# EasyEDA Pro project PCB1.epro

# Board PCB1
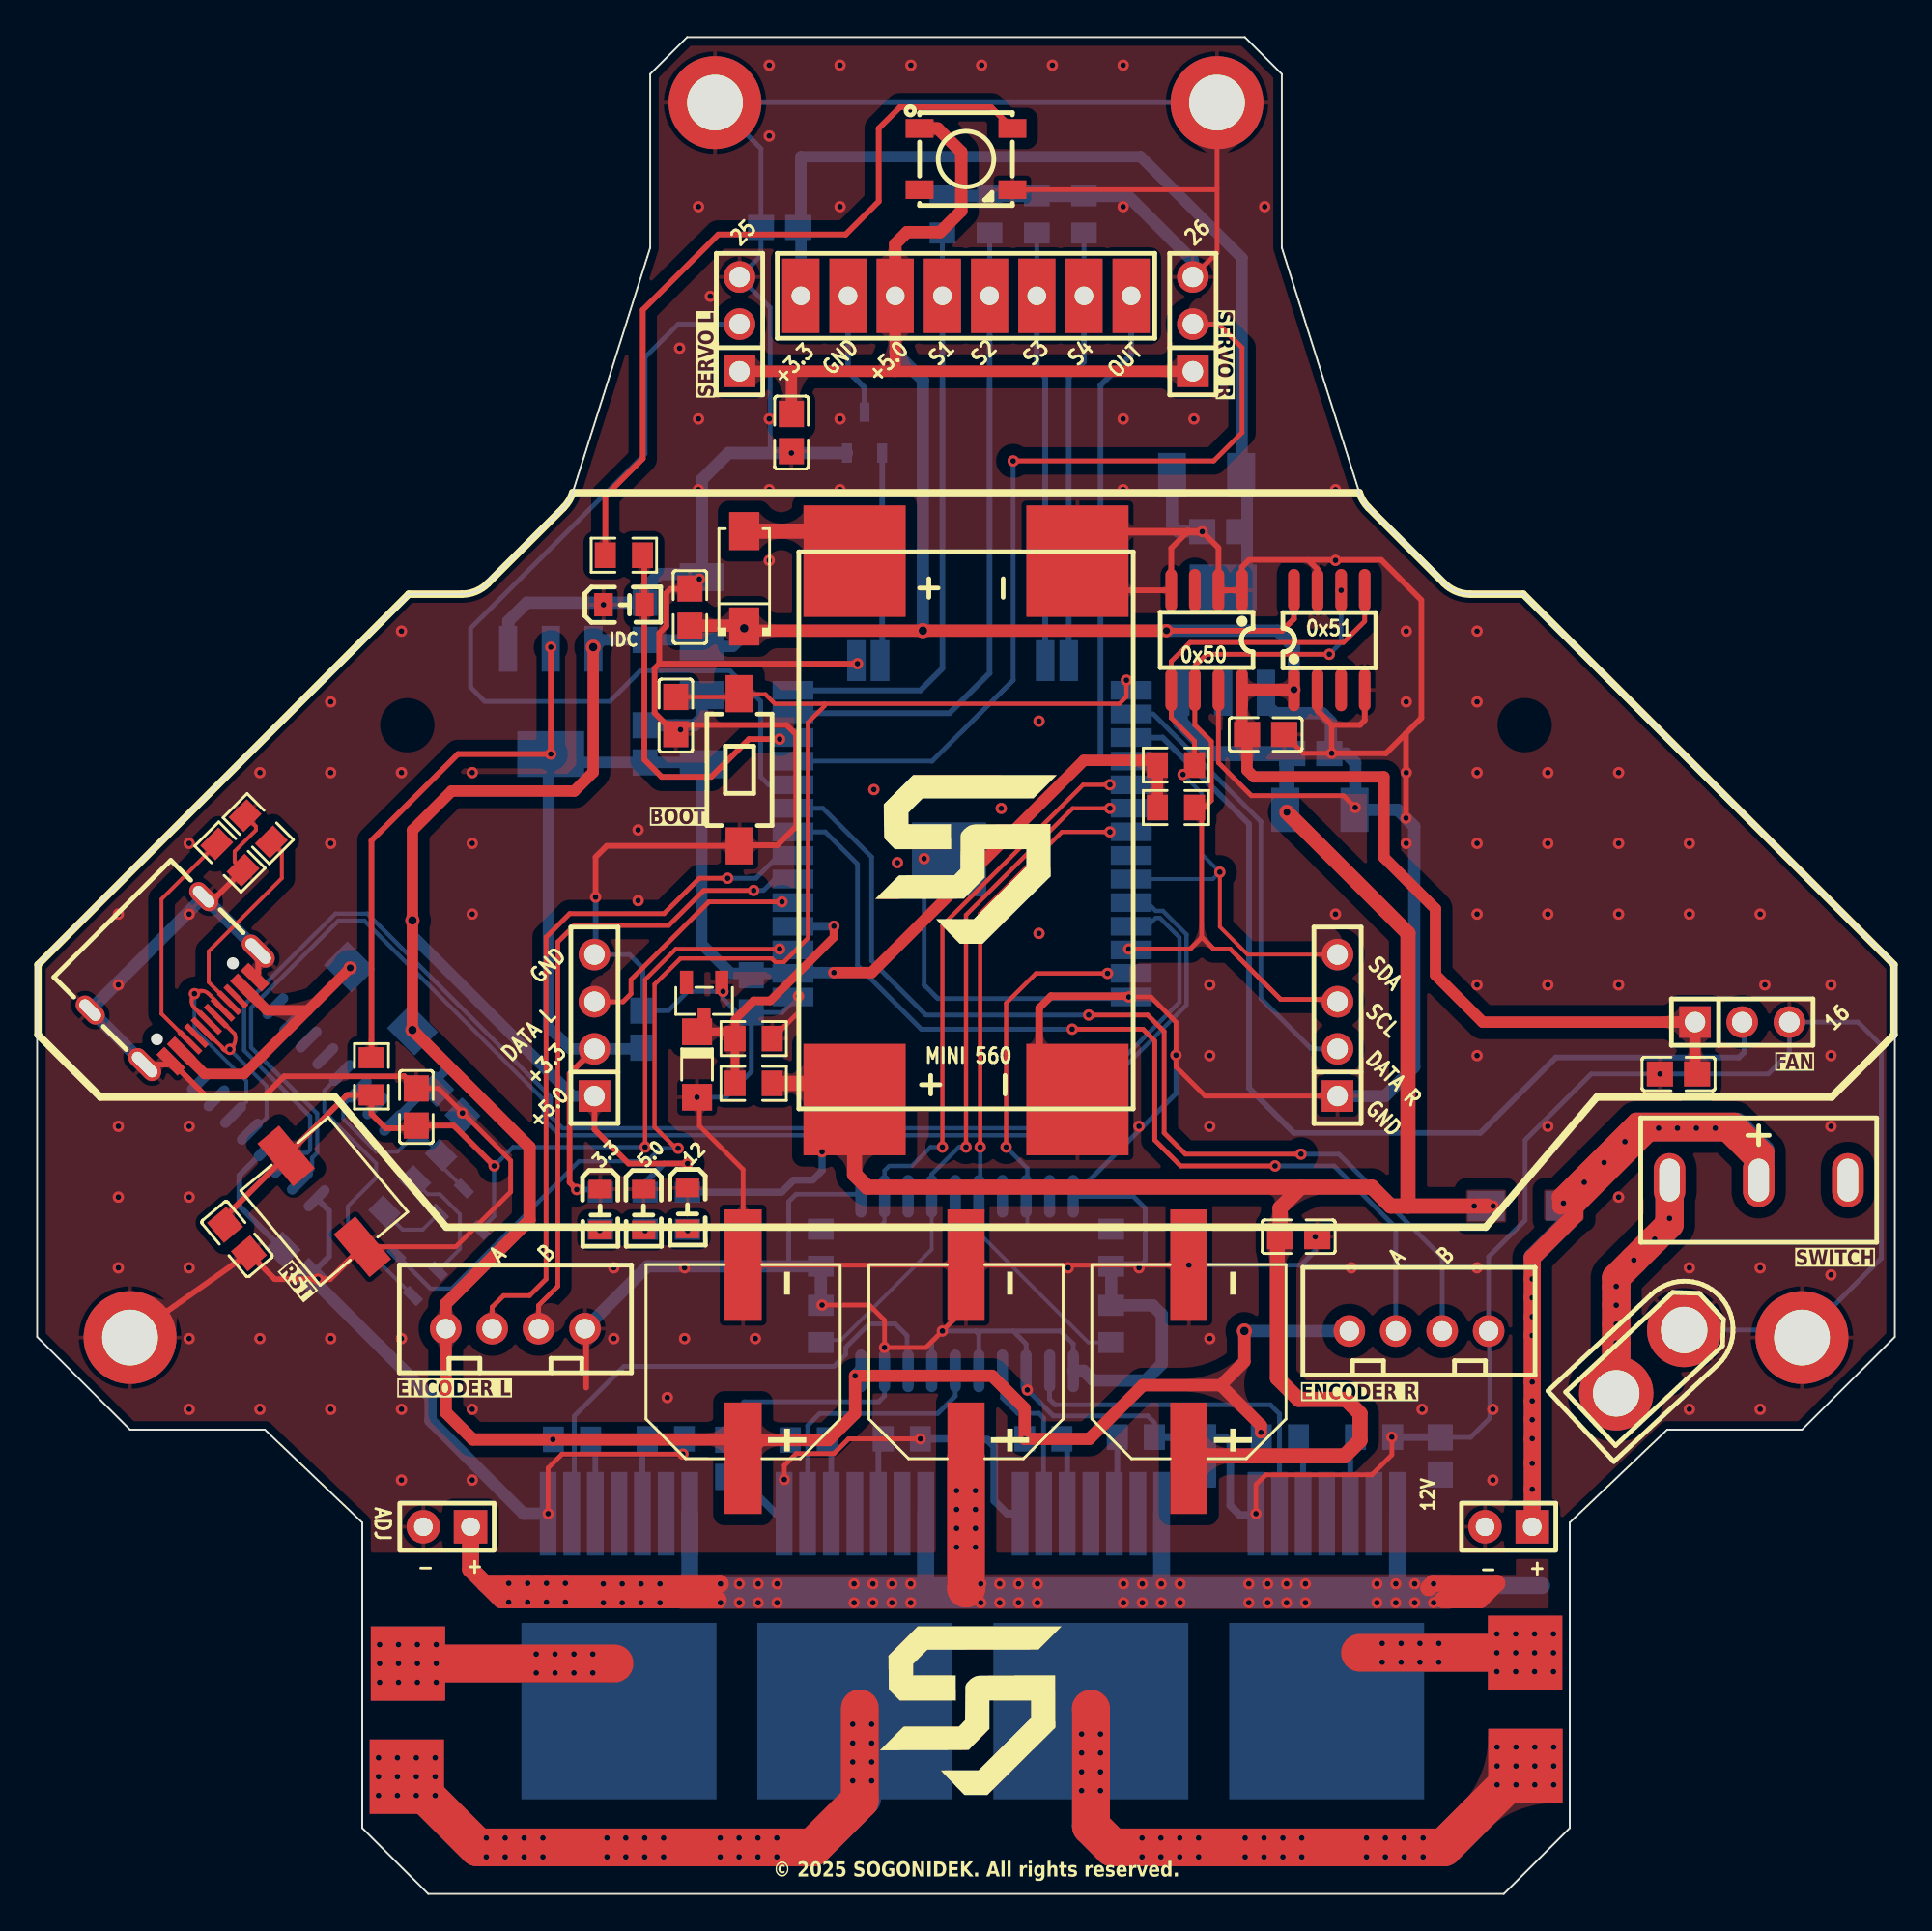
[diagram p0: board, top side]
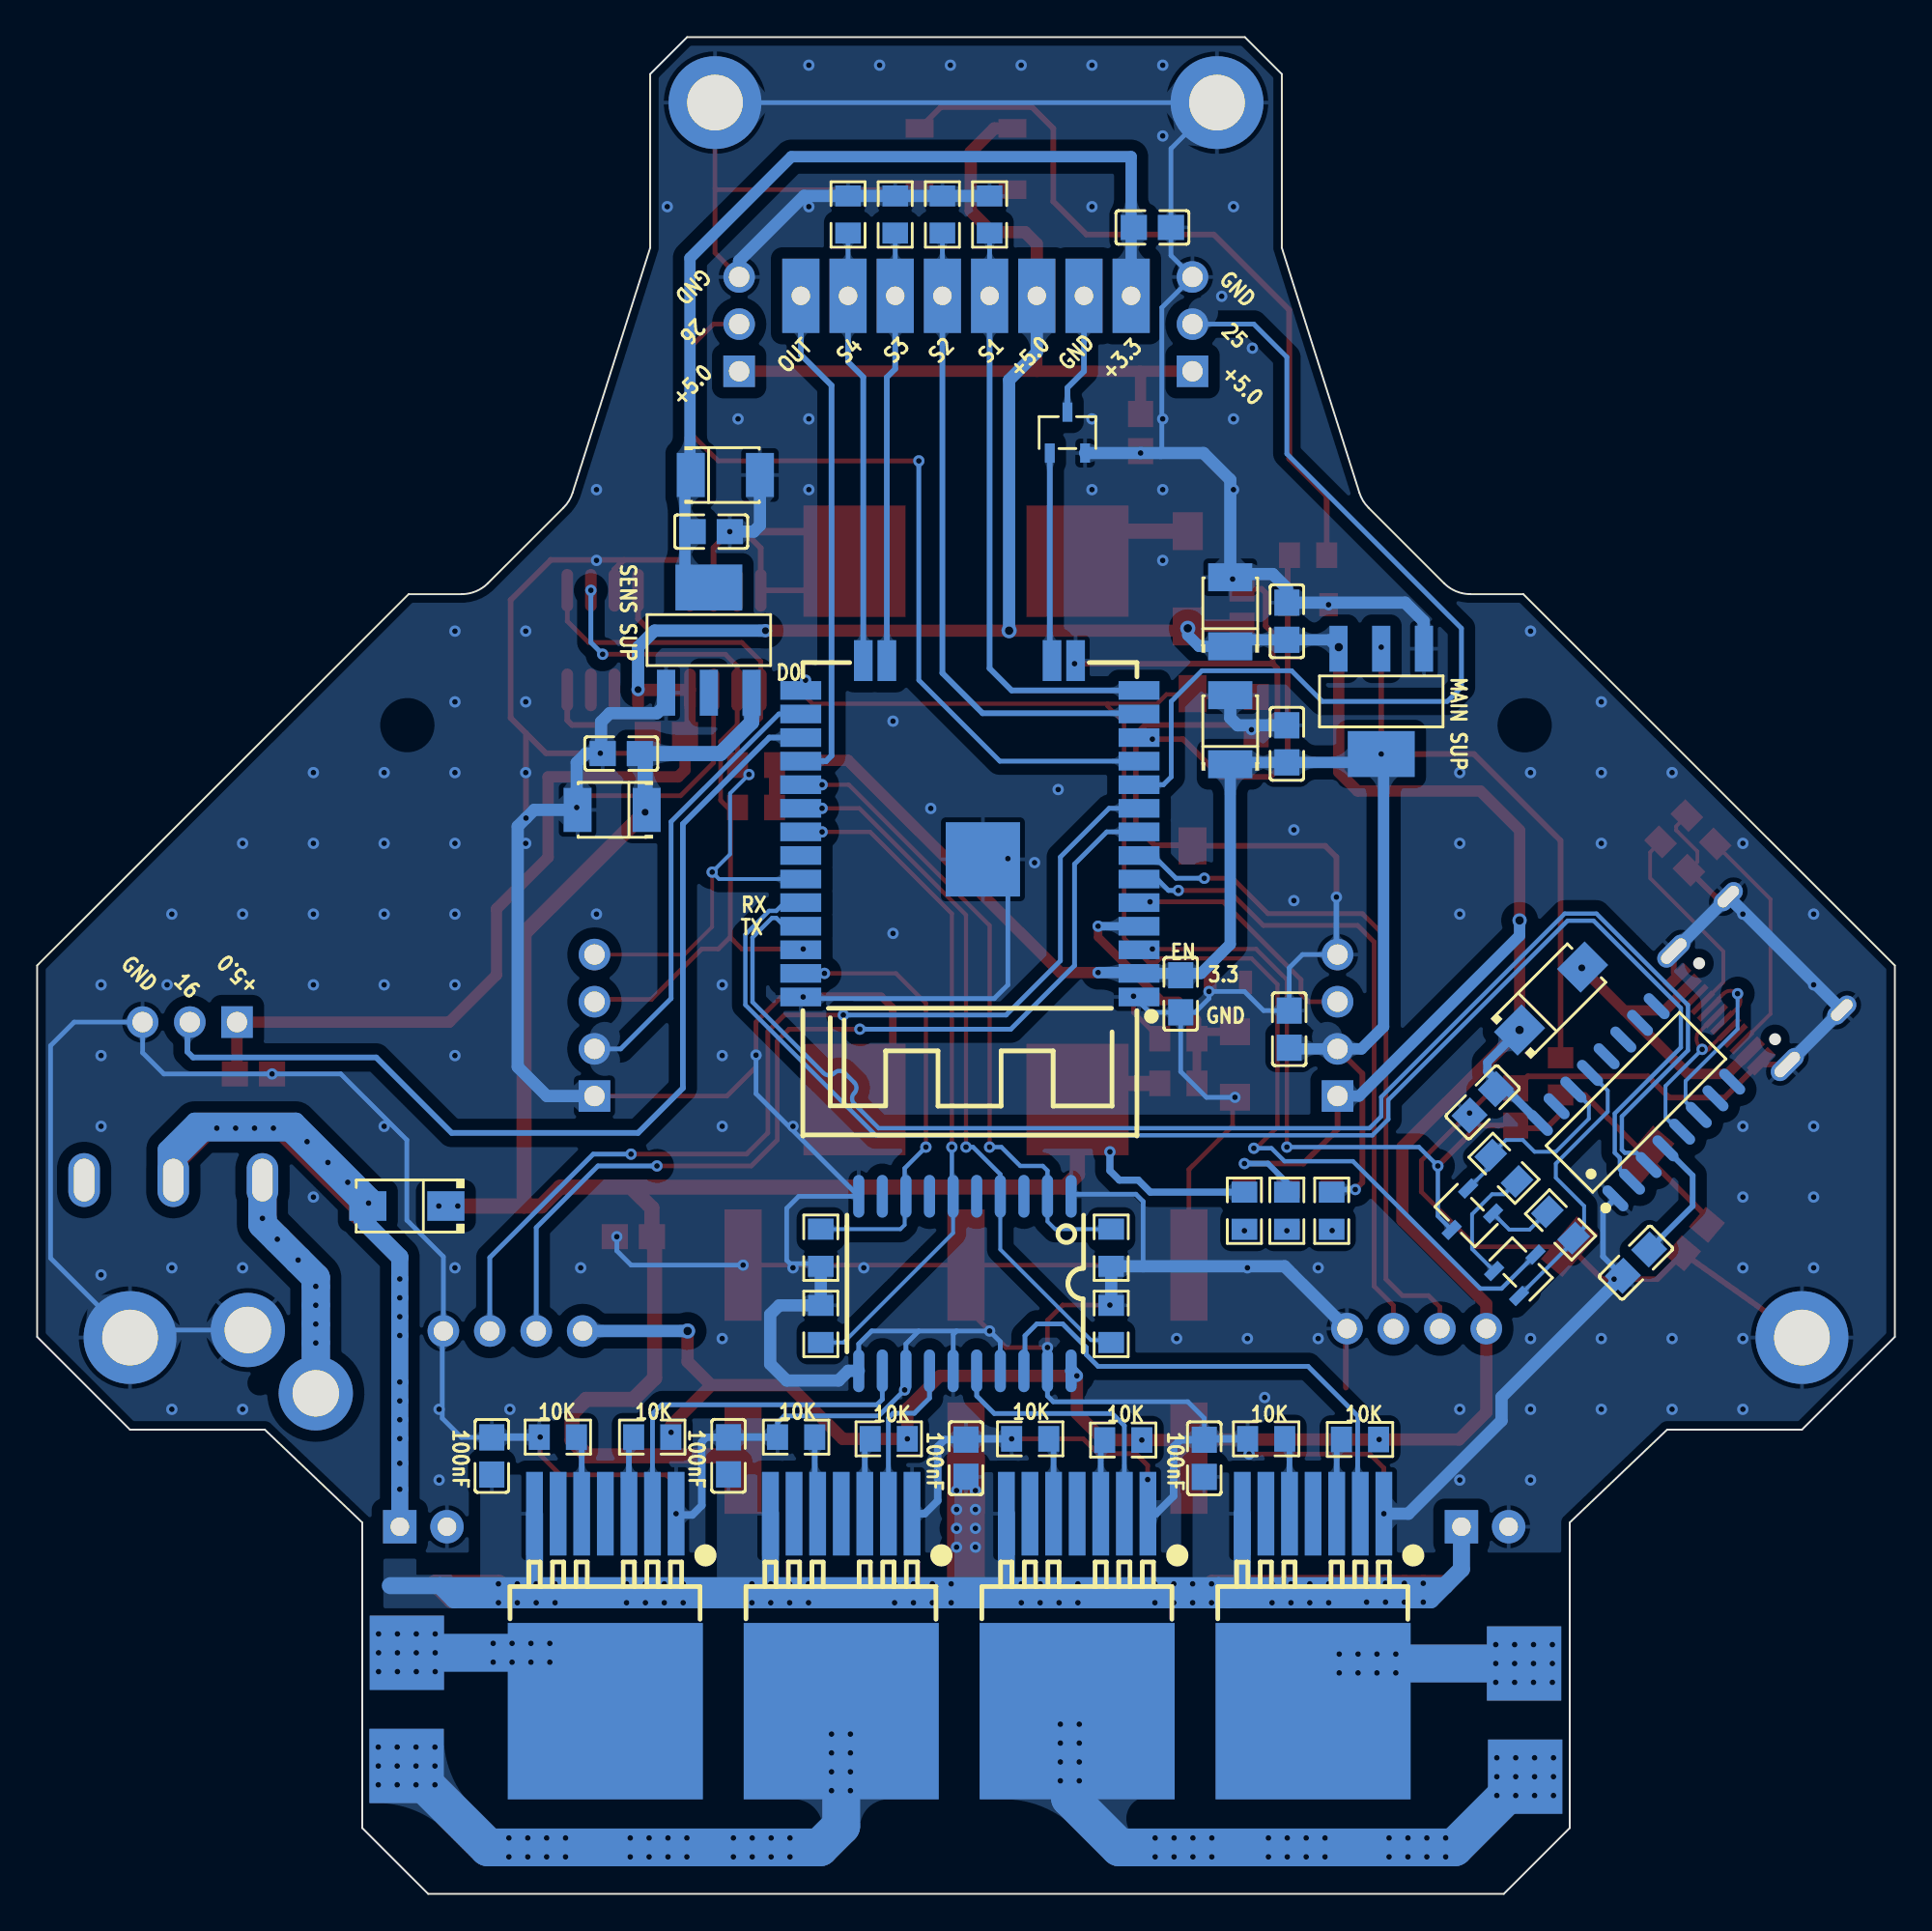
[diagram p1: board, bottom side, seen from below]

Outline 100 x 100 mm; copper layers: Top Layer, Bottom Layer. Coordinates in mm from the lower left corner of the outline.
Outline path: 0,50 0,30 5,25 12.26,25 17.5,20 17.5,3.55 21.05,0 78.95,0 82.5,3.55 82.5,20 87.74,25 95,25 100,30 100,50 80,70 77.15,70 arc(76.39,70.15) 75.74,70.59 71.67,74.65 arc(71.37,75.03) 71.18,75.47 67,88.66 67,98.01 65.01,100 34.99,100 33,98.01 33,88.66 28.82,75.47 arc(28.63,75.03) 28.33,74.65 24.26,70.59 arc(23.61,70.15) 22.85,70 20,70 0,50
Stack: Top Layer 0.035mm / Dielectric1 1.51mm FR4 er 4.5 / Bottom Layer 0.035mm

## Design rules (mm)
net TXD0: DP1
net RXD0: DP1
template: Custom Config
spacing copperThickness1oz (default): track to track 0.102, other pairs 0.152 to 0.3
spacing copperThickness2oz: track to track 0.203, other pairs 0.152 to 0.3
track width copperThickness1oz (default): min 0.127, default 0.254, max 2.54
track width copperThickness2oz: min 0.203, default 0.254, max 2.54
differential pair differentialPair (default): width min 0.127, default 0.254, max 2.54; gap min 0.152, default 0.152
via viaSize (default): diameter min 0.5, default 0.61, max 10; hole min 0.3, default 0.305, max 6.299
pour e1695 uses copperRegion
pour e456 uses copperRegion
pour e769 uses copperRegion

## Placement (name value [footprint] x y rotation side)
3.3  -  [LED0805-RD_GREEN]  30.31 36.86 270 top
5.0  -  [LED0805-RD_GREEN]  32.65 36.86 270 top
12  -  [LED0805-RD_GREEN]  35.01 36.92 270 top
12V  -  [HDR-TH_2P-P2.54-V-M-1]  79.21 19.77 180 top
C1  100nF  [C0805]  32.6 46.57 90 bottom
C2  100nF  [C0805]  40.6 78.7 270 top
C17  100nF  [C0805]  34.38 63.46 270 top
C18  100nF  [C0805]  10.76 35.27 310 top
C19  100nF  [C0805]  32.73 68.54 90 bottom
C20  100nF  [C0805]  32.73 61.94 90 bottom
C21  10uF  [CASE-B_3528]  35.78 69.05 90 bottom
C22  10uF  [CASE-B_3528]  35.78 62.7 90 bottom
C23  100nF  [C0805]  38.44 48.48 270 bottom
C24  100nF  [C0805]  39.97 89.75 180 bottom
C26  100nF  [C0805]  88.35 44.16 180 top
C27  100nF  [C0805]  66.13 62.45 0 top
C28  100nF  [C0805]  68.56 61.41 0 bottom
C29  100nF  [C0805]  63.72 73.37 180 bottom
C30  10uF  [CASE-B_3528]  69.05 58.38 0 bottom
C31  10uF  [CASE-B_3528]  62.95 76.42 180 bottom
C32  100nF  [C0805]  67.91 35.39 0 top
C33  100nF  [C0805]  35.14 69.3 90 top
C34  100nF  [C0805]  22.19 42.63 315 bottom
C35  100nF  [C0805]  13.93 34 135 bottom
C36  100nF  [C0805]  37.17 23.46 270 bottom
C37  100nF  [C0805]  75.53 23.58 270 bottom
C38  100nF  [C0805]  62.78 23.59 270 bottom
C39  100nF  [C0805]  50 23.46 270 bottom
C40  100nF  [C0805]  20.41 42.38 90 top
CN1  XT30UW-F.G.Y  [CONN-TH_XT30UW-F.G.Y]  86.83 28.66 223 top
D1  SS110  [SMA_L4.2-W2.6-LS5.1-RD]  18.5 48.22 135 bottom
D6  SS34  [SMA_L4.4-W2.8-LS5.4-RD]  38.06 70.83 90 top
D7  ZENER  [SOT-23-3_L2.9-W1.3-P1.90-LS2.4-BR]  35.9 48.09 90 top
D8  TZMB16-GS08  [SOD-80_L3.5-W1.5-RD]  35.52 44.67 270 top
DC1  Mini 560 Step-down  [MINI 560]  41 42.28 90 top
H8  -  [HDR-TH_8P-P2.54-V-M]  50 86.07 0 top
H9  PINHEADER EXT  [HDR-TH_4P-P2.54-V-F]  30 46.78 90 top
H10  PINHEADER EXT2  [HDR-TH_4P-P2.54-V-F]  70 46.78 90 top
H11  -  [HDR-TH_3P-P2.54-V-M]  37.81 84.54 90 top
H12  -  [HDR-TH_3P-P2.54-V-M]  62.21 84.54 90 top
H13  -  [HDR-TH_3P-P2.54-V-M]  91.78 46.95 0 top
H15  -  [HDR-TH_2P-P2.54-V-M-1]  22.06 19.77 180 top
IDC  -  [LED0805-RD_GREEN]  31.59 69.43 0 top
LED3  WS2812B-B/W  [LED-SMD_4P-L5.0-W5.0-BL_TC5050RGB]  50 93.43 0 top
Q1  J3Y  [SOT-23-3_L3.0-W1.7-P0.95-LS2.9-BR]  23.08 36.54 135 bottom
Q2  J3Y  [SOT-23-3_L3.0-W1.7-P0.95-LS2.9-BR]  20.12 33.65 315 bottom
Q3  J3Y  [SOT-23-3_L3.0-W1.7-P0.95-LS2.9-BR]  44.54 78.7 270 bottom
R2  10K  [R0805]  66.89 24.6 0 bottom
R3  10K  [R0805]  71.97 24.6 180 bottom
R4  10K  [R0805]  54.16 24.51 0 bottom
R5  10K  [R0805]  59.14 24.6 180 bottom
R6  10K  [R0805]  41.54 24.44 0 bottom
R7  10K  [R0805]  46.54 24.51 180 bottom
R8  10K  [R0805]  28.79 24.47 0 bottom
R9  10K  [R0805]  33.84 24.51 180 bottom
R32  10K  [R0805]  18 36.03 225 bottom
R33  10K  [R0805]  21.04 39.08 225 bottom
R43  5.1K  [R0805]  11.9 57.37 135 top
R44  5.1K  [R0805]  10.38 55.84 315 top
R45  10K  [R0805]  42.19 34.8 90 bottom
R46  10K  [R0805]  42.19 30.7 270 bottom
R48  10K  [R0805]  57.82 34.8 90 bottom
R49  10K  [R0805]  57.82 30.7 270 bottom
R50  4K7  [R0805]  61.3 60.79 180 top
R51  4K7  [R0805]  61.3 58.51 180 top
R52  10K  [R0805]  18 44.03 270 top
R54  47K  [R0805]  38.57 43.65 180 top
R55  4K7  [R0805]  38.57 46.06 0 top
R56  10K  [R0805]  56.35 90.45 90 bottom
R57  10K  [R0805]  53.81 90.45 90 bottom
R58  10K  [R0805]  51.27 90.45 90 bottom
R59  10K  [R0805]  48.73 90.45 90 bottom
R60  330  [R0805]  31.59 72.1 0 top
R61  5.1k  [R0805]  35.01 36.79 270 bottom
R63  5.1k  [R0805]  30.31 36.79 270 bottom
R64  5.1k  [R0805]  32.73 36.79 270 bottom
SW1  SWITCH  [SW-TH_SHOU-HAN_SS12D10G4]  92.67 38.44 0 top
SW2  PUSH BUTTON  [SW-SMD_L6.0-W6.0-LS6.6]  15.46 37.3 130 top
SW10  PTS636  [KEY-SMD_L6.0-W3.5-LS8.7]  37.81 60.54 90 top
U1  BTN7960  [PG-TO263-7_L9.9-W9.2-P1.27-LS14.9-BR]  69.42 15.03 90 bottom
U2  BTN7960  [PG-TO263-7_L9.9-W9.2-P1.27-LS14.9-BR]  56.72 15.03 90 bottom
U3  BTN7960  [PG-TO263-7_L9.9-W9.2-P1.27-LS14.9-BR]  44.02 15.03 90 bottom
U4  BTN7960  [PG-TO263-7_L9.9-W9.2-P1.27-LS14.9-BR]  31.32 15.03 90 bottom
U5  -  [HOLE ARRAY 3MM]  5 29.96 0 top
U6  -  [HOLE ARRAY 3MM]  95 29.96 0 top
U7  -  [HOLE ARRAY 3MM]  63.51 96.47 0 top
U8  -  [HOLE ARRAY 3MM]  36.49 96.47 0 top
U11  AT24C256M/TR  [SOP-8_L4.9-W3.9-P1.27-LS6.0-BL]  62.95 67.53 180 top
U17  CH340C  [SOP-16_L10.0-W3.9-P1.27-LS6.0-BL]  13.93 42.63 135 bottom
U19  AMS 3.3  [SOT-223-4_L6.5-W3.5-P2.30-LS7.0-BR]  27.65 64.22 90 bottom
U20  74HC244D  [SOIC-20_L12.8-W7.5-P1.27-LS10.3-TL]  50.06 32.87 270 bottom
U25  AMS 3.3  [SOT-223-4_L6.5-W3.5-P2.30-LS7.0-BR]  63.84 67.53 270 bottom
U26  470uF  [CAP-SMD_BD10.0-L10.3-W10.3-LS11.0-FD-1]  62 28.66 90 top
U27  470uF  [CAP-SMD_BD10.0-L10.3-W10.3-LS11.0-FD-1]  38 28.66 90 top
U28  470uF  [CAP-SMD_BD10.0-L10.3-W10.3-LS11.0-FD-1]  50 28.66 90 top
U31  SS54  [SMA_L4.3-W2.5-LS5.0-RD]  80.1 37.05 0 bottom
U33  ESP32-WROOM-32  [WIFIM-SMD_ESP-WROOM-32]  49.79 57.24 0 bottom
U34  AT24C256  [SOP-8_L4.9-W3.9-P1.27-LS6.0-BL]  69.56 67.53 0 top
U35  ENCODER_L  [CONN-TH_4P-P2.50-XH2.54-4P]  25.74 30.44 180 top
U36  ENCODER_R  [CONN-TH_4P-P2.50-XH2.54-4P]  74.38 30.31 180 top
U37  -  [PADSMD MOTOR]  80.1 12.98 0 top
U38  -  [PADSMD MOTOR]  80.11 6.89 0 top
U39  -  [PADSMD MOTOR]  19.9 6.31 0 top
U40  -  [PADSMD MOTOR]  19.96 12.41 0 top
USB3  TYPE-C  [USB-C-SMD_TYPE-C16PIN]  7.58 48.98 225 top

## Footprints (pads in the part's own frame, mm; a bottom-side part is the same pattern mirrored in y, then rotated)
C0805
  rect 1.41x1.35 smd: 1(-1,0) 2(1,0)
CAP-SMD_BD10.0-L10.3-W10.3-LS11.0-FD-1
  rect 6x2 smd: 1(-5.2,0) 2(5.2,0)
CASE-B_3528
  rect 1.506x2.376 smd: 1(-1.861,0) 2(1.861,0)
CONN-TH_4P-P2.50-XH2.54-4P
  round 1.7 hole 1.05: 1(3.75,0) 2(1.25,0) 3(-1.25,0) 4(-3.75,0)
CONN-TH_XT30UW-F.G.Y
  round 4 hole 2.5: 1(-2.5,0) 2(2.5,0)
HDR-TH_2P-P2.54-V-M-1
  rect 1.8x1.8 hole 1: 1(-1.27,0)
  round 1.8 hole 1: 2(1.27,0)
HDR-TH_3P-P2.54-V-M
  rect 1.7x1.7 hole 1.1: 1(-2.54,0)
  round 1.7 hole 1.1: 2(0,0) 3(2.54,0)
HDR-TH_4P-P2.54-V-F
  rect 1.7x1.7 hole 1.1: 1(-3.81,0)
  round 1.7 hole 1.1: 2(-1.27,0) 3(1.27,0) 4(3.81,0)
HDR-TH_8P-P2.54-V-M
  rect 2x4 hole 1: 1(-8.89,0) 2(-6.35,0) 3(-3.81,0) 4(-1.27,0) 5(1.27,0) 6(3.81,0) 7(6.35,0) 8(8.89,0)
HOLE ARRAY 3MM
  round 5 hole 3: 1(0,0)
KEY-SMD_L6.0-W3.5-LS8.7
  rect 2x1.5 smd: 1(-4.1,0) 2(4.1,0)
LED0805-RD_GREEN
  rect 1x1.25 smd: 1(-1.1,0) 2(1.1,0)
LED-SMD_4P-L5.0-W5.0-BL_TC5050RGB
  rect 1.5x1 smd: 1(-2.5,1.65) 2(-2.5,-1.65) 3(2.5,-1.65) 4(2.5,1.65)
MINI 560
  rect 6x5.5 smd: 1(0.5,-3) 2(0.5,-15) 3(29.5,-15) 4(29.5,-3)
PADSMD MOTOR
  rect 4x4 smd: 1(0,0)
  rect 4x4 smd far side: 2(0,0)
PG-TO263-7_L9.9-W9.2-P1.27-LS14.9-BR
  rect 4.5x0.9 smd: 1(5.444,-3.81) 2(5.444,-2.54) 3(5.444,-1.27) 4(5.444,0) 5(5.444,1.27) 6(5.444,2.54) 7(5.444,3.81)
  rect 9.5x10.5 smd: 8(-5.19,0)
R0805
  rect 1.133x1.377 smd: 1(-1,0) 2(1,0)
SMA_L4.2-W2.6-LS5.1-RD
  rect 2.1x1.8 smd: 1(-2.4,0) 2(2.4,0)
SMA_L4.3-W2.5-LS5.0-RD
  rect 2x1.593 smd: 1(-2.1,0) 2(2.1,0)
SMA_L4.4-W2.8-LS5.4-RD
  rect 2.046x1.62 smd: 1(-2.566,0) 2(2.566,0)
SOD-80_L3.5-W1.5-RD
  rect 1.44x1.62 smd: 1(-1.765,0) 2(1.765,0)
SOIC-20_L12.8-W7.5-P1.27-LS10.3-TL
  oval 2.3x0.6 smd: 1(-4.7,5.715) 2(-4.7,4.445) 3(-4.7,3.175) 4(-4.7,1.905) 5(-4.7,0.635) 6(-4.7,-0.635) 7(-4.7,-1.905) 8(-4.7,-3.175) 9(-4.7,-4.445) 10(-4.7,-5.715) 11(4.7,-5.715) 12(4.7,-4.445) 13(4.7,-3.175) 14(4.7,-1.905) 15(4.7,-0.635) 16(4.7,0.635) 17(4.7,1.905) 18(4.7,3.175) 19(4.7,4.445) 20(4.7,5.715)
SOP-8_L4.9-W3.9-P1.27-LS6.0-BL
  oval 0.63x2.3 smd: 1(-1.905,-2.683) 2(-0.635,-2.683) 3(0.635,-2.683) 4(1.905,-2.683) 5(1.905,2.683) 6(0.635,2.683) 7(-0.635,2.683) 8(-1.905,2.683)
SOP-16_L10.0-W3.9-P1.27-LS6.0-BL
  oval 0.56x1.745 smd: 1(-4.445,-2.873) 2(-3.175,-2.873) 3(-1.905,-2.873) 4(-0.635,-2.873) 5(0.635,-2.873) 6(1.905,-2.873) 7(3.175,-2.873) 8(4.445,-2.873) 9(4.445,2.873) 10(3.175,2.873) 11(1.905,2.873) 12(0.635,2.873) 13(-0.635,2.873) 14(-1.905,2.873) 15(-3.175,2.873) 16(-4.445,2.873)
SOT-23-3_L2.9-W1.3-P1.90-LS2.4-BR
  rect 1.25x0.7 smd: 1(1,-0.95) 2(1,0.95) 3(-1,0)
SOT-23-3_L3.0-W1.7-P0.95-LS2.9-BR
  rect 1.038x0.532 smd: 1(1.101,-0.95) 2(1.101,0.95) 3(-1.101,0)
SOT-223-4_L6.5-W3.5-P2.30-LS7.0-BR
  rect 2.47x0.98 smd: 1(2.835,-2.3) 2(2.835,0) 3(2.835,2.3)
  rect 2.47x3.6 smd: 4(-2.835,0)
SW-SMD_L6.0-W6.0-LS6.6
  rect 3x1.512 smd: 1(-3.192,0) 2(3.192,0)
SW-TH_SHOU-HAN_SS12D10G4
  oval 1.7x2.9 hole 1.1x2.3: 1(-4.8,0) 2(0,0) 3(4.8,0)
USB-C-SMD_TYPE-C16PIN
  oval 1x2.1 hole 0.6x1.7: 1(-4.32,1.788) 2(4.32,1.788)
  oval 1x1.8 hole 0.6x1.4: 3(-4.32,-2.362) 4(4.32,-2.362)
  rect 0.6x1.6 smd: A1B12(-3.2,2.658) A4B9(-2.4,2.658) B1A12(3.2,2.658) B4A9(2.4,2.658)
  rect 0.3x1.6 smd: A5(-1.25,2.658) A6(-0.25,2.658) A7(0.25,2.658) A8(1.25,2.658) B5(1.75,2.658) B6(0.75,2.658) B7(-0.75,2.658) B8(-1.75,2.658)
WIFIM-SMD_ESP-WROOM-32
  rect 2.2x1.001 smd: 1(-9.104,8.931) 2(-9.104,7.66) 3(-9.104,6.391) 4(-9.104,5.12) 5(-9.104,3.85) 6(-9.104,2.58) 7(-9.104,1.31) 8(-9.104,0.041) 9(-9.104,-1.23) 10(-9.104,-2.499) 11(-9.104,-3.769) 12(-9.104,-5.04) 13(-9.104,-6.309) 14(-9.104,-7.58) 25(9.104,-7.58) 26(9.104,-6.309) 27(9.104,-5.04) 28(9.104,-3.769) 29(9.104,-2.499) 30(9.104,-1.23) 31(9.104,0.041) 32(9.104,1.31) 33(9.104,2.58) 34(9.104,3.85) 35(9.104,5.12) 36(9.104,6.391) 37(9.104,7.66) 38(9.104,8.931)
  rect 1.001x2.2 smd: 15(-5.689,-9.184) 16(-4.42,-9.184) 23(4.471,-9.184) 24(5.74,-9.184)
  rect 4x4 smd: 39(-0.7,1.52)

## Nets
+3.3V: C1.1 C20.1 C22.1 C23.1 H9.2 R50.2 R51.2 R52.1 R63.1 U19.2 U19.4 U33.2
+3.3VS: C24.1 C29.1 C31.1 H8.1 U25.2 U25.4
+5V: C2.1 C19.1 C21.1 C26.1 C27.1 C33.1 C34.1 D1.1 D6.1 H8.3 H9.1 H11.1 H12.1 H13.1 LED3.1 R2.1 R4.1 R6.1 R8.1 R64.1 U11.8 U17.16 U19.3 U20.20 U27.1 U34.1 U34.8 U35.1 U36.1
+12V: 12V.1 SW1.2 U31.2
GND: 3.3.1 5.0.1 12.1 12V.2 C1.2 C2.2 C17.2 C18.2 C19.2 C20.2 C21.2 C22.2 C23.2 C24.2 C26.2 C27.2 C28.2 C29.2 C30.2 C31.2 C32.2 C33.2 C34.2 C35.1 C36.1 C37.1 C38.1 C39.1 C40.2 CN1.1 D7.1 D8.2 DC1.2 DC1.3 H9.4 H10.1 H11.3 H12.3 H13.3 H15.2 IDC.1 LED3.3 Q3.2 R3.1 R5.1 R7.1 R9.1 R43.2 R44.2 R45.1 R46.1 R48.1 R49.1 R55.2 R56.2 R57.2 R58.2 R59.2 SW2.1 SW10.1 U1.1 U2.1 U3.1 U4.1 U5.1 U6.1 U7.1 U8.1 U11.1 U11.2 U11.4 U11.7 U17.1 U19.1 U20.1 U20.10 U20.11 U20.13 U20.15 U20.17 U20.19 U25.1 U26.2 U27.2 U28.2 U33.1 U33.15 U33.38 U33.39 U34.2 U34.4 U34.7 U35.4 U36.4 USB3.1 USB3.2 USB3.3 USB3.4 USB3.A1B12 USB3.B1A12
VBAT: C28.1 C30.1 C32.1 DC1.1 R54.1 R61.1 U25.3 U26.1 U31.1
VBUS: D1.2 USB3.A4B9 USB3.B4A9
ADJ: C36.2 C37.2 C38.2 C39.2 H15.1 U1.7 U2.7 U3.7 U4.7 U28.1
BAT_SENS: D7.3 D8.1 R54.2 R55.1 U33.4
BTNL: H9.3 U33.5
BTNR: H10.2 U33.26
D0: C17.1 Q2.3 SW10.2 U33.25
D+: U17.5 USB3.A6 USB3.B6
D-: U17.6 USB3.A7 USB3.B7
DTR: Q2.2 R32.2 U17.13
EN: C18.1 C40.1 Q1.3 R52.2 SW2.2 U33.3
ENA_SENS: Q3.1 U33.16
ENCL1: U33.7 U35.2
ENCL2: U33.6 U35.3
ENCR1: U33.8 U36.2
ENCR2: U33.9 U36.3
FAN: H13.2 U33.27
IL1: R48.2 U20.8 U33.37
IL2: R49.2 U20.6 U33.31
IR1: R46.2 U20.4 U33.30
IR2: R45.2 U20.2 U33.29
LED: IDC.2 R60.2 U33.12
LED_CON: LED3.4 R60.1
OUT_ML1: U2.8 U38.1 U38.2
OUT_ML2: U1.8 U37.1 U37.2
OUT_MR1: U4.8 U40.1 U40.2
OUT_MR2: U3.8 U39.1 U39.2
PWM_ML1: U2.2 U20.14
PWM_ML2: U1.2 U20.12
PWM_MR1: U4.2 U20.18
PWM_MR2: U3.2 U20.16
RTS: Q1.2 R33.1 U17.14
RXD0: U17.2 U33.34
SCL: H10.3 R51.1 U11.6 U33.36 U34.6
SDA: H10.4 R50.1 U11.5 U33.33 U34.5
SERVO1: H12.2 U33.11
SERVO2: H11.2 U33.10
SIGNAL: H8.8 U33.28
SL0: H8.4 R59.1 U33.14
SL1: H8.5 R58.1 U33.13
SL2: H8.6 R57.1 U33.23
SL3: H8.7 R56.1 U33.24
TXD0: U17.3 U33.35
$1N1166: R2.2 U1.3
$1N1207: R3.2 U1.5
$1N1568: R5.2 U2.5
$1N1572: R4.2 U2.3
$1N1784: R7.2 U3.5
$1N1788: R6.2 U3.3
$1N2000: R9.2 U4.5
$1N2004: R8.2 U4.3
$2N1057: CN1.2 SW1.1
$2N1549: D6.2 DC1.4
$3N1556: C35.2 U17.4
$3N1567: R44.1 USB3.B5
$3N1569: R43.1 USB3.A5
$3N1572: Q2.1 R33.2
$3N1574: Q1.1 R32.1
$3N5348: H8.2 Q3.3
$3N17844: 12.2 R61.2
$3N17968: 3.3.2 R63.2
$3N18030: 5.0.2 R64.2

Pads without a net: D7 2; LED3 2; SW1 3; U1 4 6; U2 4 6; U3 4 6; U4 4 6; U11 3; U17 7 8 9 10 11 12 15; U20 3 5 7 9; U33 32; U34 3; USB3 A8 B8

## Via types
v1: diameter 0.813, hole 0.457, Top Layer to Bottom Layer, 4 vias
v2: diameter 0.61, hole 0.305, Top Layer to Bottom Layer, 416 vias
v3: diameter 0.762, hole 0.457, Top Layer to Bottom Layer, 2 vias
v4: diameter 0.711, hole 0.381, Top Layer to Bottom Layer, 4 vias

## Routing (per net, layer and track width the routed paths; a pad name or vN(x,y) marks a point on that pad's centre or on a via; arc(x,y) is an arc through that point)
+3.3V: length 109.5
  Top Layer w0.305: v2(27.65,67.14) v2(27.65,61.39) 22.65,61.39 18,56.73 R52.1 ; H9.2 28.66,44.17 28.66,38.32 v2(29.04,37.93)
  Top Layer w0.61: v2(42.89,49.62) 44.92,49.62 56.35,61.05 60.05,61.05 R50.2 R51.2
  Bottom Layer w0.305: v2(29.04,37.93) 30.17,37.93 R63.1 ; v2(27.65,67.14) U19.2
  Bottom Layer w0.61: C1.1 32.54,45.51 H9.2 28.71,45.51 27.52,46.7 27.52,61.26 v2(27.65,61.39) 28.1,60.94 C20.1 35.68,60.94 C22.1 35.78,51.14 37.34,49.58 40.94,49.58 40.98,49.62 v2(42.89,49.62)
+3.3VS: length 52.6
  Bottom Layer w0.61: H8.1 41.11,93.56 59.4,93.56 64.86,88.1 64.86,76.33 65.03,76.16 65.13,76.16 65.13,70.49 63.97,70.49 63.84,70.36
+5V: length 308.8
  Top Layer w0.305: H9.1 30,41.17 31.84,39.33 v2(35.01,39.33) ; U34.8 67.65,68.67 67.02,68.03 v4(60.79,68.03)
  Top Layer w0.61: H8.3 46.19,82.04 46.16,82 ; v1(29.93,67.14) 29.93,60.41 28.92,59.4 22.31,59.4 20.2,57.28 v3(20.2,52.43) v3(20.2,46.52) ; H11.1 40.65,82 ; 40.65,82 40.6,81.96 C2.1 ; 40.65,82 46.16,82 ; 46.16,82 H12.1 ; v1(38.06,68.16) D6.1 ; U11.8 64.86,62.72 C27.1 65.13,60.52 65.49,60.16 72.5,60.16 72.5,55.83 75.27,53.05 75.27,49.49 77.81,46.95 H13.1 89.24,44.27 C26.1
  Top Layer w0.66: v1(64.99,30.31) 64.99,28.66 63.72,27.39 ; v3(20.2,46.52) 26.5,40.22 26.5,36.28 21.99,31.77 U35.1 21.99,25.94 23.46,24.47 v2(27.76,24.47) 38,24.47 U27.1 38.98,24.44 v2(40.54,24.44) 42.6,24.44 44.03,25.87 v2(44.03,27.9) 51.4,27.9 53.16,26.14 v2(53.16,24.51) 56.64,24.51 59.53,27.39 63.72,27.39 ; v4(67.65,64.86) U34.1 U11.8 ; 63.72,27.39 65.88,25.23 v2(65.88,24.85) ; C33.1 38.02,68.3 D6.1 38.29,68.03 v1(47.68,68.03) v4(60.79,68.03) ; LED3.1 48.48,95.08 49.75,93.81 49.75,90.64 48.6,89.5 46.82,89.5 46.19,88.86 H8.3
  Bottom Layer w0.305: v2(35.01,39.33) 33.74,39.33 32.73,38.32 R64.1
  Bottom Layer w0.457: v3(20.2,46.52) 21.93,44.79 21.93,44.28 20.99,43.34 20.93,43.34 U17.16 ; v1(29.93,67.14) 29.95,67.13 U19.3
  Bottom Layer w0.61: v3(20.2,52.43) 20.2,51.6 28.84,42.97 H9.1 ; U19.3 30.43,67.54 C19.1 35.42,67.54 C21.1 37.45,67.19 38.06,67.8 v1(38.06,68.16)
  Bottom Layer w0.66: v4(60.79,68.03) 66.76,68.03 67.65,67.14 v4(67.65,64.86) ; H8.3 46.19,83.02 47.68,81.53 v1(47.68,68.03) ; v2(65.88,24.85) 65.88,24.62 R2.1 ; v2(44.03,27.9) 44.3,28.17 U20.20 ; v1(64.99,30.31) U36.1
+12V: length 104.6
  Top Layer w0.914: 82.26,37.3 v2(83.28,38.32) v2(84.35,39.39) v2(85.47,40.51) 85.94,40.98 86.19,40.98 ; 80.48,19.76 v2(80.48,21.79) v2(80.48,23.19) v2(80.48,24.52) v2(80.48,25.53) v2(80.48,26.55) v2(80.48,27.57) v2(80.48,30.07) v2(80.48,31.09) v2(80.48,32.1) v2(80.48,33.12) 80.48,34.25 82.77,36.54 82.77,36.96 86.79,40.98 90.89,40.98 92.67,39.2 SW1.2 93.05,38.82 93.05,39.97 91.4,41.62 86.07,41.62 82,37.54 82,37.05
  Bottom Layer w0.914: 80.48,34.25 80.48,34.31 82.2,36.03 82.2,37.05 82.5,37.05 ; 80.48,34.25 v2(80.48,33.12) v2(80.48,32.1) v2(80.48,31.09) v2(80.48,30.07) v2(80.48,27.57) v2(80.48,26.55) v2(80.48,25.53) v2(80.48,24.52) v2(80.48,23.19) v2(80.48,21.79) 80.48,19.76 ; 80.48,34.25 82.5,36.27 82.5,37.05 ; 82.5,37.05 82.51,37.05 86.45,40.98 91.02,40.98 92.67,39.33 92.67,37.81 93.05,38.19 93.05,40.09 91.53,41.62 86.07,41.62 82,37.54 82,37.05
  vias: v2(82.16,37.2) v2(87.28,41.24) v2(88.3,41.24) v2(89.31,41.24) v2(90.33,41.24)
GND: length 722.6
  Top Layer w0.203: R44.2 10.63,55.59 10.63,56.15 11.77,57.29 11.77,57.49 R43.2
  Top Layer w0.254: D7.1 36.92,49.03 v2(36.92,48.6) ; v2(65.61,20.48) 65.61,22.05 66.13,22.57 71.84,22.57 72.92,23.65 v2(72.92,24.6) ; 63.51,91.85 63.45,91.78 LED3.3 ; 63.51,91.85 U7.1 ; 63.51,91.85 63.51,88.38 H12.3 ; v2(27.51,20.48) 27.51,22.93 28.26,23.69 v2(34.76,23.69) ; SW2.1 22.54,34.85 25.49,37.81 25.49,39.49 21.6,43.38 C40.2 ; U28.2 U27.2 38,39.01 35.65,41.36 35.65,42.77 v2(35.52,42.9) ; U28.2 50,31.58 v2(48.73,30.31) 47.84,29.43 v2(45.61,29.43) 45.61,30.89 44.79,31.71 v2(42.25,31.71) ; U28.2 v2(62,33.86) ; v2(47.54,24.51) 43.68,24.51 42.89,23.71 40.86,23.71 40.22,23.08 v2(40.22,22.31) ; v2(69.69,61.43) 68.15,61.43 C27.2 ; v2(70.96,58.51) 70.32,59.14 65.37,59.14 63.59,60.92 U11.7 ; R55.2 40.98,47.48 v2(40.98,48.35) ; v2(58.77,48.31) 59.95,48.31 61.3,46.95 v2(61.3,45.17) 61.3,44.54 62.87,42.97 H10.1 ; v2(68.8,35.39) C32.2
  Top Layer w0.305: U34.7 68.92,71.34 68.41,71.84 ; 69.69,62.95 68.92,63.72 U34.2 ; 69.69,62.95 71.21,62.95 71.46,63.21 U34.4 ; 69.69,62.95 v2(69.69,61.43) 72.61,61.43 73.69,62.51 ; USB3.2 6.97,44.67 7.17,44.87 9.15,42.89 12.15,42.89 13.3,44.03 19.76,44.03 C40.2 ; 33.49,66.26 33.24,66 33.24,63.6 C17.2 34.62,62.7 v2(34.63,62.7) 34.89,62.95 40.35,62.95 40.86,62.45 40.86,57.49 39.84,56.48 37.84,56.48 SW10.1 30.66,56.44 30.06,55.84 v2(30.06,53.68) ; 33.49,66.26 33.49,67.91 33.87,68.29 33.87,70.07 34.09,70.28 35.12,70.28 C33.2 ; 33.49,66.26 v2(44.16,66.26) ; 73.69,62.51 v2(73.69,57.94) ; 73.69,62.51 74.51,63.33 74.51,69.68 72.35,71.84 68.41,71.84 ; v2(62.72,73.37) 63.59,72.49 U11.2 U11.1 64.86,71.46 65.24,71.84 68.41,71.84 ; SW2.1 15.76,33.11 v2(15.11,33.11) 12.79,33.11 C18.2 U5.1 ; 61.94,73.37 61.05,72.48 U11.4 57.57,70.21 DC1.3 ; 11.7,49.39 11.9,49.59 USB3.1 ; R44.2 9.66,53.71 USB3.3 ; U35.4 29.55,30.38 29.55,27.27
  Top Layer w0.406: v2(58.77,48.31) 58.72,48.35 54.57,48.35 53.94,47.71 53.94,44.84 DC1.2 ; DC1.3 57.59,73.37 v2(62.72,73.37)
  Bottom Layer w0.254: 50.51,30.31 v2(48.73,30.31) 48.15,29.74 U20.17 ; 50.51,30.31 50.69,30.14 50.69,28.18 U20.15 ; 50.51,30.31 52.54,30.31 ; v2(35.52,42.9) 37.06,42.9 38.44,44.28 C23.2 ; C37.1 77.16,24.58 78.19,25.62 78.19,30.25 U36.4 78.13,34.32 80.1,36.28 80.1,40.6 83.66,44.16 v2(87.35,44.16) 93.18,44.16 94.32,45.3 94.32,46.95 98.01,46.95 99.28,45.68 99.28,34.24 U6.1 94.59,30.37 88.66,30.37 ; U3.1 40.22,20.49 v2(40.22,22.31) ; R5.1 60.14,25.38 59.78,25.74 54.7,25.74 v2(53.3,27.14) 53.3,28.1 U20.13 53.23,29.62 52.54,30.31 ; C23.2 40.11,47.48 v2(40.98,48.35) ; C23.2 37.66,47.48 36.92,48.22 v2(36.92,48.6) 35.01,48.6 33.98,47.57 C1.2 32.6,49.87 31.88,50.59 H9.4 ; C36.1 37.17,25.62 38.06,26.5 45.3,26.5 45.61,26.82 U20.19 ; 39.51,77.6 39.46,77.65 39.46,85.43 H11.3 38.97,88.24 C24.2 38.97,93.99 U8.1 U7.1 ; v2(62,33.86) 68.03,33.86 68.8,34.63 v2(68.8,35.39) ; R9.1 34.76,24.42 v2(34.76,23.69) ; v2(61.3,45.17) 61.3,43.1 U20.10 59,37.57 59.65,36.92 59.65,34.12 59.47,33.95 57.96,33.95 R48.1 ; 52.54,30.31 55.08,30.31 55.77,29.62 U20.11 ; R46.1 42.2,31.71 v2(42.25,31.71) ; v2(47.75,55.76) 47.75,48.95 48.48,48.22 58.68,48.22 v2(58.77,48.31) ; 40.46,33.8 40.46,37.29 40.86,37.68 44.23,37.68 U20.1
  Bottom Layer w0.305: 14.66,33.27 15.71,34.33 15.71,36.79 U17.1 ; v2(44.16,66.26) 44.16,66.22 44.1,66.17 ; 14.82,33.11 v2(15.11,33.11) ; v2(30.06,53.68) 30.06,50.65 H9.4 ; 34.4,62.94 v2(34.63,62.7) ; v2(35.65,70.81) 35.75,70.91
  Bottom Layer w0.406: R5.1 62.78,24.6 C38.1 63.98,24.59 64.22,24.35 64.22,20.92 64.73,20.41 65.54,20.41 v2(65.61,20.48) ; U3.1 39.77,20.48 38.82,21.42 38.82,24.09 38.46,24.46 C36.1 37.12,24.51 R9.1 ; R3.1 75.51,24.6 C37.1 ; v2(47.54,24.51) 49.96,24.51 C39.1 51.15,24.46 51.52,24.09 51.52,21.17 52.22,20.48 U2.1
  Bottom Layer w0.457: U20.19 v2(45.61,29.43)
  Bottom Layer w0.66: Q3.2 v2(40.6,77.6) 37.21,77.6 35.78,76.16 C21.2 35.6,71.08 33.49,71.08 32.73,70.32 C19.2 26.36,69.54 25.36,68.54 25.36,67.07 U19.1 ; U25.1 66.14,64.08 66.64,63.59 69.18,63.59 69.64,63.12 69.64,61.5 C28.2 70.46,61.41 70.96,60.92 v2(70.96,58.51) 70.96,58.43 C30.2 73.24,58.38 v2(73.69,57.94) 74.13,57.49 74.13,44.54 72.56,42.97 H10.1 ; v2(27.51,20.48) 26.18,20.48 21.17,25.49 21.17,26.76 C35.1 ; U35.4 32.85,33.8 R45.1 R46.1 ; R59.2 R58.2 R57.2 R56.2 58.72,91.45 62.21,87.95 H12.3 ; C22.2 35.78,63.33 35.38,62.94 C20.2 ; R48.1 R49.1 60.05,31.7 60.54,31.2 60.54,28.54 59.65,27.65 56.86,27.65 56.34,28.17 U20.11 ; USB3.1 USB3.3 USB3.4 USB3.2 ; v2(62.72,73.37) 61.43,73.37 61.09,73.7 C31.2
  vias: v2(4.37,52.77) v2(4.37,48.96) v2(4.37,41.34) v2(4.37,37.53) v2(4.37,33.72) v2(8.18,56.58) v2(8.18,52.77) v2(8.18,41.34) v2(8.18,37.53) v2(8.18,33.72) v2(8.18,29.91) v2(8.18,26.1) v2(11.99,60.39) v2(11.99,29.91) v2(11.99,26.1) v2(15.8,64.2) v2(15.8,60.39) v2(15.8,56.58) v2(15.8,29.91) v2(15.8,26.1) v2(19.61,68.01) v2(19.61,60.39) v2(19.61,29.91) v2(19.61,26.1) v2(19.61,22.29) v2(22.89,42.05) v2(23.42,60.39) v2(23.42,56.58) v2(23.42,52.77) v2(23.42,26.1) v2(23.42,22.29) v2(30.49,69.43) v2(31.04,33.72) v2(31.04,29.91) v2(32.35,57.3) v2(32.35,53.49) v2(33.92,26.73) v2(34.58,83.25) v2(34.85,33.72) v2(34.85,29.91) v2(35.6,90.87) v2(35.6,79.44) v2(35.6,75.63) v2(36.24,86.04) v2(38.66,29.91) v2(39.41,98.49) v2(39.41,94.68) v2(39.41,79.44) v2(39.41,75.63) v2(39.41,71.82) v2(43.22,98.49) v2(43.22,90.87) v2(43.22,79.44) v2(43.22,75.63) v2(45.04,59.48) v2(46.31,55.54) v2(47.03,98.49) v2(50.84,98.49) v2(51.9,58.46) v2(53.93,63.16) v2(53.93,51.73) v2(54.65,98.49) v2(55.5,33.72) v2(58.46,98.49) v2(58.46,90.87) v2(58.46,79.44) v2(58.46,75.63) v2(59.31,41.34) v2(59.31,33.72) v2(62.27,79.44) v2(63.12,48.96) v2(63.12,45.15) v2(63.12,41.34) v2(63.12,29.91) v2(66.08,90.87) v2(69.89,75.63) v2(69.89,71.82) v2(69.89,52.77) v2(70.74,33.72) v2(73.7,68.01) v2(73.7,64.2) v2(73.7,60.39) v2(73.7,56.58) v2(74.55,26.1) v2(77.51,68.01) v2(77.51,64.2) v2(77.51,60.39) v2(77.51,56.58) v2(77.51,52.77) v2(77.51,48.96) v2(77.51,45.15) v2(77.51,33.72) v2(78.36,26.1) v2(78.36,22.29) v2(81.32,60.39) v2(81.32,56.58) v2(81.32,52.77) v2(81.32,48.96) v2(81.32,41.34) v2(85.13,60.39) v2(85.13,56.58) v2(85.13,52.77) v2(85.13,48.96) v2(85.13,37.53) v2(88.94,56.58) v2(88.94,52.77) v2(88.94,33.72) v2(88.94,26.1) v2(92.75,52.77) v2(92.75,33.72) v2(92.75,26.1) v2(93,48.96) v2(96.56,48.96) v2(96.56,45.15) v2(96.56,41.34) v2(96.56,33.34)
VBAT: length 118.9
  Top Layer w0.381: DC1.1 42.25,41.03 v2(42.25,39.97)
  Top Layer w0.813: R54.1 43.13,43.65 DC1.1 44,38.75 44.69,38.06 68.03,38.06 ; 68.03,38.06 71.84,38.06 72.86,37.05 73.79,37.05 ; 68.03,38.06 66.91,36.93 C32.1 66.76,35.25 66.76,27.77 67.91,26.63 70.45,26.63 71.21,25.87 71.21,24.42 70.38,23.59 62.13,23.59 U26.1 ; 73.79,37.05 v2(77.36,37.05) 78.07,37.05 ; 73.79,37.05 73.79,51.74 v4(67.27,58.25)
  Bottom Layer w0.381: R61.1 40.08,37.79 40.73,38.44 41.75,38.44 42.25,38.95 v2(42.25,39.97)
  Bottom Layer w0.813: 78.07,37.05 U31.1 ; C30.1 67.27,58.3 67.27,61.13 C28.1 63.22,61.41 61.54,63.09 61.54,64.69
  Bottom Layer w0.914: v2(78.38,37.05) 78.07,37.05
VBUS: length 16
  Top Layer w0.559: 7.74,45.43 9.01,44.16 11.14,44.16 14.57,47.59 ; 14.57,47.59 v4(16.85,49.87) ; 14.57,47.59 12.37,47.59 11.13,48.83
  Bottom Layer w0.559: v4(16.85,49.87) 16.81,49.92
ADJ: length 175.3
  Top Layer w0.914: 74.9,16.48 75.15,16.73 78.57,16.73 77.69,15.84 75.65,15.84 ; 24.09,16.73 23.33,17.49 H15.1 ; 24.09,16.73 v2(25.39,16.73) v2(26.4,16.73) v2(27.42,16.73) v2(28.43,16.73) 36.75,16.73 v2(36.78,16.7) ; 24.09,16.73 24.98,15.84 36.66,15.84
  Top Layer w2.032: U28.1 50,16.44 50.03,16.44
  Bottom Layer w0.914: U3.7 47.83,16.6 ; 47.83,16.6 36.41,16.6 ; 47.83,16.6 60.53,16.6 ; 35.13,16.61 35.14,16.6 ; 35.13,16.61 35.13,16.6 ; 35.13,16.61 U4.7 ; 35.14,16.6 36.41,16.6 ; 35.14,16.6 35.13,16.6 ; 35.14,16.6 35.9,15.84 ; 24.22,16.6 35.13,16.6 ; 24.22,16.6 23.33,17.49 H15.1 ; 24.22,16.6 24.98,15.84 35.9,15.84 ; 78.32,16.6 77.56,15.84 35.9,15.84 ; 78.32,16.6 80.99,16.6 ; 78.32,16.6 73.23,16.6 ; 36.41,16.6 36.79,16.22 ; 73.23,16.6 U1.7 ; 73.23,16.6 60.53,16.6 ; 60.53,16.6 U2.7
  vias: v2(25.39,15.71) v2(26.4,15.71) v2(27.42,15.71) v2(28.43,15.71) v2(30.48,16.7) v2(30.48,15.68) v2(31.49,16.7) v2(31.49,15.68) v2(32.51,16.7) v2(32.51,15.68) v2(33.53,16.7) v2(33.53,15.68) v2(36.78,15.68) v2(37.8,16.7) v2(37.8,15.68) v2(38.81,16.7) v2(38.81,15.68) v2(39.83,16.7) v2(39.83,15.68) v2(43.98,16.7) v2(43.98,15.68) v2(44.99,16.7) v2(44.99,15.68) v2(46.01,16.7) v2(46.01,15.68) v2(47.02,16.7) v2(47.02,15.68) v2(49.49,21.72) v2(49.49,20.7) v2(49.49,19.69) v2(49.49,18.67) v2(50.51,21.72) v2(50.51,20.7) v2(50.51,19.69) v2(50.51,18.67) v2(50.8,16.7) v2(50.8,15.68) v2(51.81,16.7) v2(51.81,15.68) v2(52.83,16.7) v2(52.83,15.68) v2(53.84,16.7) v2(53.84,15.68) v2(58.48,16.7) v2(58.48,15.68) v2(59.49,16.7) v2(59.49,15.68) v2(60.51,16.7) v2(60.51,15.68) v2(61.53,16.7) v2(61.53,15.68) v2(65.23,16.7) v2(65.23,15.68) v2(66.24,16.7) v2(66.24,15.68) v2(67.26,16.7) v2(67.26,15.68) v2(68.27,16.7) v2(68.27,15.68) v2(72.12,16.7) v2(72.12,15.68) v2(73.14,16.7) v2(73.14,15.68) v2(74.15,16.7) v2(74.15,15.68) v2(75.17,16.7) v2(75.17,15.68)
BAT_SENS: length 16
  Top Layer w0.457: v2(42.89,52.12) 42.89,51.52 39.46,48.09 38.57,48.09 37.57,47.09 37.57,46.4 ; D7.3 35.9,46.81 D8.1 37.53,46.43 37.57,46.4 ; 37.57,46.4 R55.1 R54.2
  Bottom Layer w0.457: 40.94,52.12 v2(42.89,52.12)
BTNL: length 12.8
  Top Layer w0.254: v2(40.09,53.43) 36.16,53.43 31.97,49.24 31.97,48.48 31.54,48.05 H9.3
BTNR: length 24.4
  Bottom Layer w0.254: 58.64,63.55 60.08,63.55 65.88,57.75 65.88,48.22 68.59,45.51 H10.2
D0: length 77.1
  Top Layer w0.229: v2(34.51,40.16) 34.38,40.16 33.24,41.3 33.24,48.98 34.63,50.38 39.54,50.38 39.73,50.19 40.2,50.19 41.49,51.48 41.49,63.08 42.38,63.97 42.38,64.1 ; 42.38,64.1 58.25,64.1 58.64,64.48 v2(58.64,65.37) ; 42.38,64.1 39.71,64.1 39.21,64.6 37.84,64.6 37.81,64.64 37.63,64.46 C17.1
  Bottom Layer w0.229: v2(34.51,40.16) 33.55,40.16 32.85,39.46 29.17,39.46 22.31,32.6 21.17,32.6 Q2.3 ; v2(58.64,65.37) 58.64,64.82 58.64,64.82
D+: length 10.1
  Top Layer w0.203: 9.61,47.31 10.63,46.32 arc(10.65,45.86) v2(10.37,45.48) arc(10.12,45.42) 9.94,45.61 8.91,46.6
  Bottom Layer w0.203: U17.5 11.52,40.99 11.52,40.99 12.34,41.81 12.34,43.51 v2(10.37,45.48)
D-: length 11.9
  Top Layer w0.203: 9.26,46.95 8.47,47.71 arc(8.31,48.1) v2(8.47,48.48) arc(8.84,48.64) 9.22,48.49 9.36,48.35 arc(9.68,48.02) 9.97,47.66
  Bottom Layer w0.203: U17.6 11.27,42.66 11.27,43.78 8.47,46.58 v2(8.47,48.48)
DTR: length 15.6
  Bottom Layer w0.203: U17.13 15.46,43.26 15.46,42.13 18.25,39.33 18.25,38.57 16.73,37.05 16.73,35.89 R32.2 17.29,35.14 Q2.2
EN: length 50.2
  Top Layer w0.229: v2(39.97,50.89) 34.38,50.89 32.73,49.24 v2(32.73,40.22)
  Top Layer w0.305: C18.1 10.11,36.46 SW2.2 16.69,43.03 R52.2 18,42 18.76,41.24 20.27,41.24 C40.1 22.42,41.38 v2(24.6,39.2)
  Bottom Layer w0.229: 23.86,35.76 24.6,36.5 v2(24.6,39.2) 25.62,40.22 v2(32.73,40.22) ; v2(39.97,50.89) 40.9,50.89 40.94,50.85
ENA_SENS: length 11.5
  Bottom Layer w0.305: 45.37,66.17 45.49,66.28 Q3.1
ENCL1: length 38.5
  Top Layer w0.254: v2(37.17,54.7) 35.65,54.7 33.74,52.79 28.66,52.79 27.39,51.52 27.39,33.11 26.5,32.22 25.11,32.22 24.49,31.6 U35.2
  Bottom Layer w0.254: v2(37.17,54.7) 38.7,54.7 39.92,55.93 40.94,55.93
ENCL2: length 35.6
  Top Layer w0.254: U35.3 26.99,31.69 28.03,32.73 28.03,51.27 28.92,52.16 34,52.16 35.88,54.04 v2(38.57,54.04)
  Bottom Layer w0.254: 40.94,54.66 39.71,54.66 39.1,54.04 v2(38.57,54.04)
ENCR1: length 52.9
  Top Layer w0.254: v2(66.64,39.2) 61.56,39.2 60.16,40.6 60.16,45.94 59.53,46.57 v2(55.72,46.57)
  Bottom Layer w0.254: v2(55.72,46.57) 47.59,46.57 44.16,50 44.16,55.46 42.42,57.2 40.94,57.2 ; v2(66.64,39.2) 69.81,39.2 73.13,35.88 U36.2
ENCR2: length 55.1
  Top Layer w0.254: v2(56.6,47.33) 59.78,47.33 60.67,46.44 60.67,40.98 61.81,39.84 v2(68.03,39.84)
  Bottom Layer w0.254: 40.94,58.47 42.3,58.47 44.92,55.84 44.92,50.25 47.84,47.33 v2(56.6,47.33) ; U36.3 75.63,34.27 70.07,39.84 v2(68.03,39.84)
FAN: length 53.9
  Bottom Layer w0.305: H13.2 91.91,46.82 91.91,45.35 91.6,45.05 81.75,45.05 77.69,40.98 67.65,40.98 65.24,43.4 65.24,57.62 60.58,62.28 58.64,62.28
IL1: length 24.2
  Top Layer w0.229: v2(52.16,40.22) 52.16,47.97 53.77,49.58 v2(57.62,49.58)
  Bottom Layer w0.203: U20.8 53.3,37.5 53.3,36.03 53.53,35.8 R48.2
  Bottom Layer w0.229: v2(52.16,40.22) 53.3,39.08 53.3,37.64 U20.8 ; 58.64,49.58 v2(57.62,49.58)
IL2: length 36.5
  Top Layer w0.229: v2(50.76,40.22) 50.76,52.79 55.16,57.2 v2(57.75,57.2)
  Bottom Layer w0.203: R49.2 56.59,29.7 50.69,35.59 U20.6
  Bottom Layer w0.229: U20.6 50.76,37.64 v2(50.76,40.22) ; 58.64,57.2 v2(57.75,57.2)
IR1: length 38.1
  Top Layer w0.229: v2(50,40.22) 50,52.72 55.75,58.47 v2(57.75,58.47)
  Bottom Layer w0.203: U20.4 48.15,34.71 43.27,29.82 42.31,29.82 R46.2
  Bottom Layer w0.229: U20.4 48.15,38.76 49.62,40.22 v2(50,40.22) ; 58.64,58.47 v2(57.75,58.47)
IR2: length 35
  Top Layer w0.229: v2(57.75,59.74) 56.31,59.74 48.73,52.16 v2(48.73,40.22)
  Bottom Layer w0.203: R45.2 45.2,35.8 45.61,36.22 U20.2
  Bottom Layer w0.229: 58.64,59.74 v2(57.75,59.74) ; U20.2 45.61,38.95 45.87,39.2 47.08,39.2 48.09,40.22 v2(48.73,40.22)
LED: length 20.6
  Top Layer w0.305: v2(39.97,62.19) 38.32,62.19 36.28,60.16 33.62,60.16 32.69,61.09 IDC.2 32.69,72 R60.2
  Bottom Layer w0.305: v2(39.97,62.19) 40.86,62.19 40.94,62.28
LED_CON: length 41.2
  Top Layer w0.305: LED3.4 51.36,96.23 46.44,96.23 45.3,95.08 45.3,91.15 43.52,89.37 36.66,89.37 32.6,85.31 32.6,77.3 30.59,75.29 R60.1
OUT_ML1: length 63.9
  Top Layer w2.032: 56.72,9.97 56.73,9.96 56.73,3.64 57.87,2.5 75.73,2.5 U38.1
  Bottom Layer w2.032: U2.8 56.72,3.66 57.87,2.5 75.73,2.5 U38.1
  vias: v2(56.22,8.61) v2(56.22,7.59) v2(56.22,6.57) v2(56.22,5.56) v2(57.24,8.61) v2(57.24,7.59) v2(57.24,6.57) v2(57.24,5.56) v2(59.47,3.01) v2(59.47,1.99) v2(60.49,3.01) v2(60.49,1.99) v2(61.51,3.01) v2(61.51,1.99) v2(62.52,3.01) v2(62.52,1.99) v2(65.03,3.01) v2(65.03,1.99) v2(66.04,3.01) v2(66.04,1.99) v2(67.06,3.01) v2(67.06,1.99) v2(68.07,3.01) v2(68.07,1.99) v2(71.56,3.01) v2(71.56,1.99) v2(72.57,3.01) v2(72.57,1.99) v2(73.59,3.01) v2(73.59,1.99) v2(74.61,3.01) v2(74.61,1.99) v2(78.59,7.9) v2(78.59,6.89) v2(78.59,5.87) v2(79.6,7.9) v2(79.6,6.89) v2(79.6,5.87) v2(80.62,7.9) v2(80.62,6.89) v2(80.62,5.87) v2(81.64,7.9) v2(81.64,6.89) v2(81.64,5.87)
OUT_ML2: length 20.9
  Top Layer w2.032: U37.1 v2(79.59,12.98) v2(78.57,12.98) 71.21,12.98
  Bottom Layer w2.032: U1.8 72.56,12.98 v2(78.57,12.98) v2(79.59,12.98) U37.1
  vias: v2(72.4,13.49) v2(72.4,12.48) v2(73.42,13.49) v2(73.42,12.48) v2(74.44,13.49) v2(74.44,12.48) v2(75.45,13.49) v2(75.45,12.48) v2(78.57,14) v2(78.57,11.97) v2(79.59,14) v2(79.59,11.97) v2(80.61,14) v2(80.61,12.98) v2(80.61,11.97) v2(81.62,14) v2(81.62,12.98) v2(81.62,11.97)
OUT_MR1: length 23.5
  Top Layer w2.032: U40.1 v2(20.47,12.41) v2(21.48,12.41) 31.08,12.41
  Bottom Layer w2.032: U4.8 28.75,12.41 v2(21.48,12.41) v2(20.47,12.41) U40.1
  vias: v2(18.44,13.42) v2(18.44,12.41) v2(18.44,11.39) v2(19.45,13.42) v2(19.45,12.41) v2(19.45,11.39) v2(20.47,13.42) v2(20.47,11.39) v2(21.48,13.42) v2(21.48,11.39) v2(26.86,12.92) v2(26.86,11.9) v2(27.88,12.92) v2(27.88,11.9) v2(28.9,12.92) v2(28.9,11.9) v2(29.91,12.92) v2(29.91,11.9)
OUT_MR2: length 63.3
  Top Layer w2.032: 44.28,9.99 44.28,5.04 41.75,2.5 23.71,2.5 20.16,6.06
  Bottom Layer w2.032: U3.8 44.41,9.45 44.41,5.17 41.75,2.5 23.71,2.5 20.16,6.06
  vias: v2(18.38,7.33) v2(18.38,6.31) v2(18.38,5.3) v2(19.39,7.33) v2(19.39,6.31) v2(19.39,5.3) v2(20.41,7.33) v2(20.41,6.31) v2(20.41,5.3) v2(21.42,7.33) v2(21.42,6.31) v2(21.42,5.3) v2(24.18,3.01) v2(24.18,1.99) v2(25.19,3.01) v2(25.19,1.99) v2(26.21,3.01) v2(26.21,1.99) v2(27.23,3.01) v2(27.23,1.99) v2(30.67,3.01) v2(30.67,1.99) v2(31.69,3.01) v2(31.69,1.99) v2(32.71,3.01) v2(32.71,1.99) v2(33.72,3.01) v2(33.72,1.99) v2(36.77,3.01) v2(36.77,1.99) v2(37.78,3.01) v2(37.78,1.99) v2(38.8,3.01) v2(38.8,1.99) v2(39.82,3.01) v2(39.82,1.99) v2(43.9,9.14) v2(43.9,8.12) v2(43.9,7.1) v2(43.9,6.09) v2(44.92,9.14) v2(44.92,8.12) v2(44.92,7.1) v2(44.92,6.09)
PWM_ML1: length 9.3
  Bottom Layer w0.254: U20.14 51.96,26.7 52.78,25.88 53.92,25.88 54.18,25.63 U2.2
PWM_ML2: length 19.6
  Bottom Layer w0.254: U20.12 54.5,26.63 54.79,26.34 66.38,26.34 66.88,25.85 U1.2
PWM_MR1: length 27.7
  Bottom Layer w0.254: U20.18 46.82,28.23 46.82,30.06 46.19,30.7 44.79,30.7 43.52,29.43 43.52,29.04 42.89,28.41 31.59,28.41 28.92,25.74 28.92,20.62 U4.2
PWM_MR2: length 14.7
  Bottom Layer w0.254: U3.2 41.48,25.22 42.13,25.87 48.48,25.87 49.42,26.82 U20.16
RTS: length 10.8
  Bottom Layer w0.203: Q1.2 21.75,39.21 R33.1 20.93,40.6 20.03,40.6 19.39,39.97 18.25,39.97 16.47,41.74 16.47,42.48 U17.14
RXD0: length 79.6
  Bottom Layer w0.229: U17.2 14.8,39.01 14.8,39.64 15.08,39.92 15.08,42.03 11.52,45.59 11.52,47.71 16.22,52.41 17.61,52.41 27.27,42.76 27.27,41.71 28.13,40.86 54.86,40.86 61.87,47.87 61.87,51.67 60.6,52.94 60.21,52.94 59.77,53.39 58.64,53.39
SCL: length 40.1
  Top Layer w0.254: 62.68,51.51 62.72,51.51 63.34,50.89 64.22,50.89 66.94,48.18 69.87,48.18 H10.3 ; 62.68,51.51 62.06,50.89 v2(58.76,50.89) ; 62.68,51.51 62.68,58.13 R51.1 62.83,58.51 63.21,58.89 63.21,62.06 62.32,62.95 U11.6 62.32,66.13 62.95,66.76 v2(69.56,66.76)
  Bottom Layer w0.254: v2(70.19,70.21) 70.19,67.4 v2(69.56,66.76) ; v2(58.76,50.89) 58.68,50.89 58.64,50.85
SDA: length 41.1
  Top Layer w0.203: R50.1 61.79,60.29 v2(61.68,60.29) ; H10.4 65.16,50.59 63.66,52.08 v2(63.66,55.03)
  Top Layer w0.254: R50.1 62.3,62.08 61.05,63.33 U11.5 61.05,66.38 62.06,67.4 70.32,67.4 71.46,68.54 U34.5
  Bottom Layer w0.203: v2(61.68,60.29) 62.7,59.27 62.7,55.99 v2(63.66,55.03) 63.29,54.66 58.64,54.66
SERVO1: length 45.9
  Top Layer w0.254: H12.2 63.59,84.54 64.86,83.27 64.86,78.7 63.34,77.18 v2(52.54,77.18)
  Bottom Layer w0.254: v2(52.54,77.18) 52.54,65.37 48.18,61.01 40.94,61.01
SERVO2: length 51
  Bottom Layer w0.254: H11.2 34.51,84.54 32.73,82.77 32.73,77.56 23.33,68.16 23.33,64.99 24.09,64.22 30.82,64.22 32.47,65.87 37.3,65.87 38.95,64.22 38.95,60.16 39.38,59.74 40.94,59.74
SIGNAL: length 27
  Bottom Layer w0.305: H8.8 58.89,82.89 57.24,81.24 57.24,61.3 57.54,61.01 58.64,61.01
SL0: length 31.7
  Bottom Layer w0.254: R59.1 H8.4
  Bottom Layer w0.305: H8.4 48.73,66 47.54,64.82 40.94,64.82
SL1: length 34.9
  Bottom Layer w0.254: R58.1 H8.5
  Bottom Layer w0.305: H8.5 51.27,65.75 49.11,63.59 40.98,63.59 40.94,63.55
SL2: length 23.5
  Bottom Layer w0.254: R57.1 H8.6
  Bottom Layer w0.305: H8.6 53.81,82.13 54.26,81.68 54.26,66.17
SL3: length 23.6
  Bottom Layer w0.254: R56.1 H8.7
  Bottom Layer w0.305: H8.7 56.35,82.51 55.53,81.69 55.53,66.17
TXD0: length 79.5
  Bottom Layer w0.229: U17.3 13.9,39.91 14.53,39.91 14.69,40.07 14.69,41.87 11.14,45.43 11.14,47.87 16.06,52.79 17.77,52.79 27.65,42.92 27.65,41.87 28.28,41.24 54.7,41.24 56.02,42.55 arc(56.13,42.84) 56.02,43.13 arc(55.9,43.41) 56.02,43.7 56.52,44.2 arc(56.81,44.32) 57.09,44.2 arc(57.38,44.09) 57.67,44.2 61.49,48.03 61.49,51.51 60.44,52.56 60.21,52.56 59.77,52.12 58.64,52.12
$1N1166: length 4.2
  Bottom Layer w0.305: R2.2 68.15,24.34 U1.3
$1N1207: length 4.2
  Bottom Layer w0.305: R3.2 70.69,24.32 U1.5
$1N1568: length 4.2
  Bottom Layer w0.305: R5.2 58.14,20.63 U2.5
$1N1572: length 4.2
  Bottom Layer w0.305: R4.2 55.45,24.22 U2.3
$1N1784: length 4.1
  Bottom Layer w0.305: U3.5 45.29,24.25 R7.2
$1N1788: length 4.1
  Bottom Layer w0.305: U3.3 42.75,24.23 R6.2
$1N2000: length 4.1
  Bottom Layer w0.305: U4.5 32.59,24.25 R9.2
$1N2004: length 4.1
  Bottom Layer w0.305: U4.3 30.05,24.22 R8.2
$2N1057: length 25.3
  Top Layer w1.524: 85,26.96 v2(85,29.67) v2(85,30.69) v2(85,31.7) v2(85,32.72) 85,33.19 v2(85.95,34.13) v2(87.07,35.26) 87.87,36.06 v2(87.87,36.38) SW1.1
  Bottom Layer w1.524: SW1.1 v2(87.87,36.38) 87.87,36.06 v2(87.07,35.26) v2(85.95,34.13) 85,33.19 v2(85,32.72) v2(85,31.7) v2(85,30.69) v2(85,29.67) 85,26.96
$2N1549: length 6.6
  Top Layer w0.813: D6.2 42.39,73.39 DC1.4
$3N1556: length 7
  Bottom Layer w0.305: U17.4 10.88,38.69 10.88,37.05 C35.2
$3N1567: length 12.5
  Top Layer w0.203: 8.2,45.89 6.69,47.4 6.69,53.57 R44.1
$3N1569: length 11
  Top Layer w0.203: 10.32,48.01 9.23,49.1 9.23,50.76 13.17,54.7 13.17,56.1 R43.1
$3N1572: length 6.7
  Bottom Layer w0.203: Q2.1 22.76,34.73 22.76,36.6 21.68,37.68 21.03,37.68 R33.2
$3N1574: length 3.7
  Bottom Layer w0.203: R32.1 19.66,35.78 20.76,35.78 Q1.1
$3N5348: length 6.6
  Bottom Layer w0.305: Q3.3 44.54,81.11 43.65,82 H8.2
$3N17844:
  vias: v2(35.01,35.72)
$3N17968:
  vias: v2(30.29,35.72)
$3N18030:
  vias: v2(32.73,35.72)

## Copper pours and planes (outline as drawn; the poured copper is in the pictures)
+12V on Top Layer: 81.12,37.93 83.26,37.93 83.26,36.27 81.12,36.27
GND on Top Layer: -0.93,101.94 102.83,101.94 102.83,18.38 -0.93,18.38
GND on Bottom Layer: -1.31,102.07 101.18,102.07 101.18,18.38 -1.31,18.38
VBAT on Top Layer: 76.92,37.93 79.08,37.93 79.08,36.16 76.92,36.16
ADJ on Top Layer: 34.55,17.21 76.16,17.21 76.16,15.33 34.55,15.33
ADJ on Top Layer: 79.59,17.18 79.59,18.04 81.37,18.04 81.37,15.37 77.64,15.37 77.64,17.18
ADJ on Bottom Layer: 60.36,22.59 63.41,22.59 63.41,16.75 60.36,16.75
ADJ on Bottom Layer: 34.76,22.69 37.81,22.69 37.81,16.85 34.76,16.85
ADJ on Bottom Layer: 73.1,22.58 76.15,22.58 76.15,16.74 73.1,16.74
ADJ on Bottom Layer: 79.58,17.19 79.58,18.05 81.36,18.05 81.36,15.38 77.63,15.38 77.63,17.19
ADJ on Bottom Layer: 47.58,22.71 50.62,22.71 50.62,16.87 47.58,16.87

Small or netless copper shapes (teardrops, artwork), in the pictures only: 206 on Top Layer, 302 on Bottom Layer

## Text on the board
Bottom Silkscreen Layer: +3.3 | GND | +5.0 | S1 | S2 | S3 | S4 | OUT | 10K | 3.3 | EN | D0 | RX | TX | 25 | MAIN SUP | 100nF | SENS SUP | 26 | 16
Top Silkscreen Layer: A | DATA L | +3.3 | +5.0 | GND | B | 25 | S1 | S2 | S3 | S4 | OUT | 26 | 16 | ADJ | SCL | DATA R | SDA | - | + | MINI 560 | 0x50 | 0x51 | RST | BOOT | © 2025 SOGONIDEK. All rights reserved. | SERVO L | SERVO R | ENCODER L | ENCODER R | FAN | SWITCH
